# EAGLE design MRCS-ATSN (EAGLE 7.7.0)
Dynamic/Electret Dispatcher/Operator board by Clint Gilliland
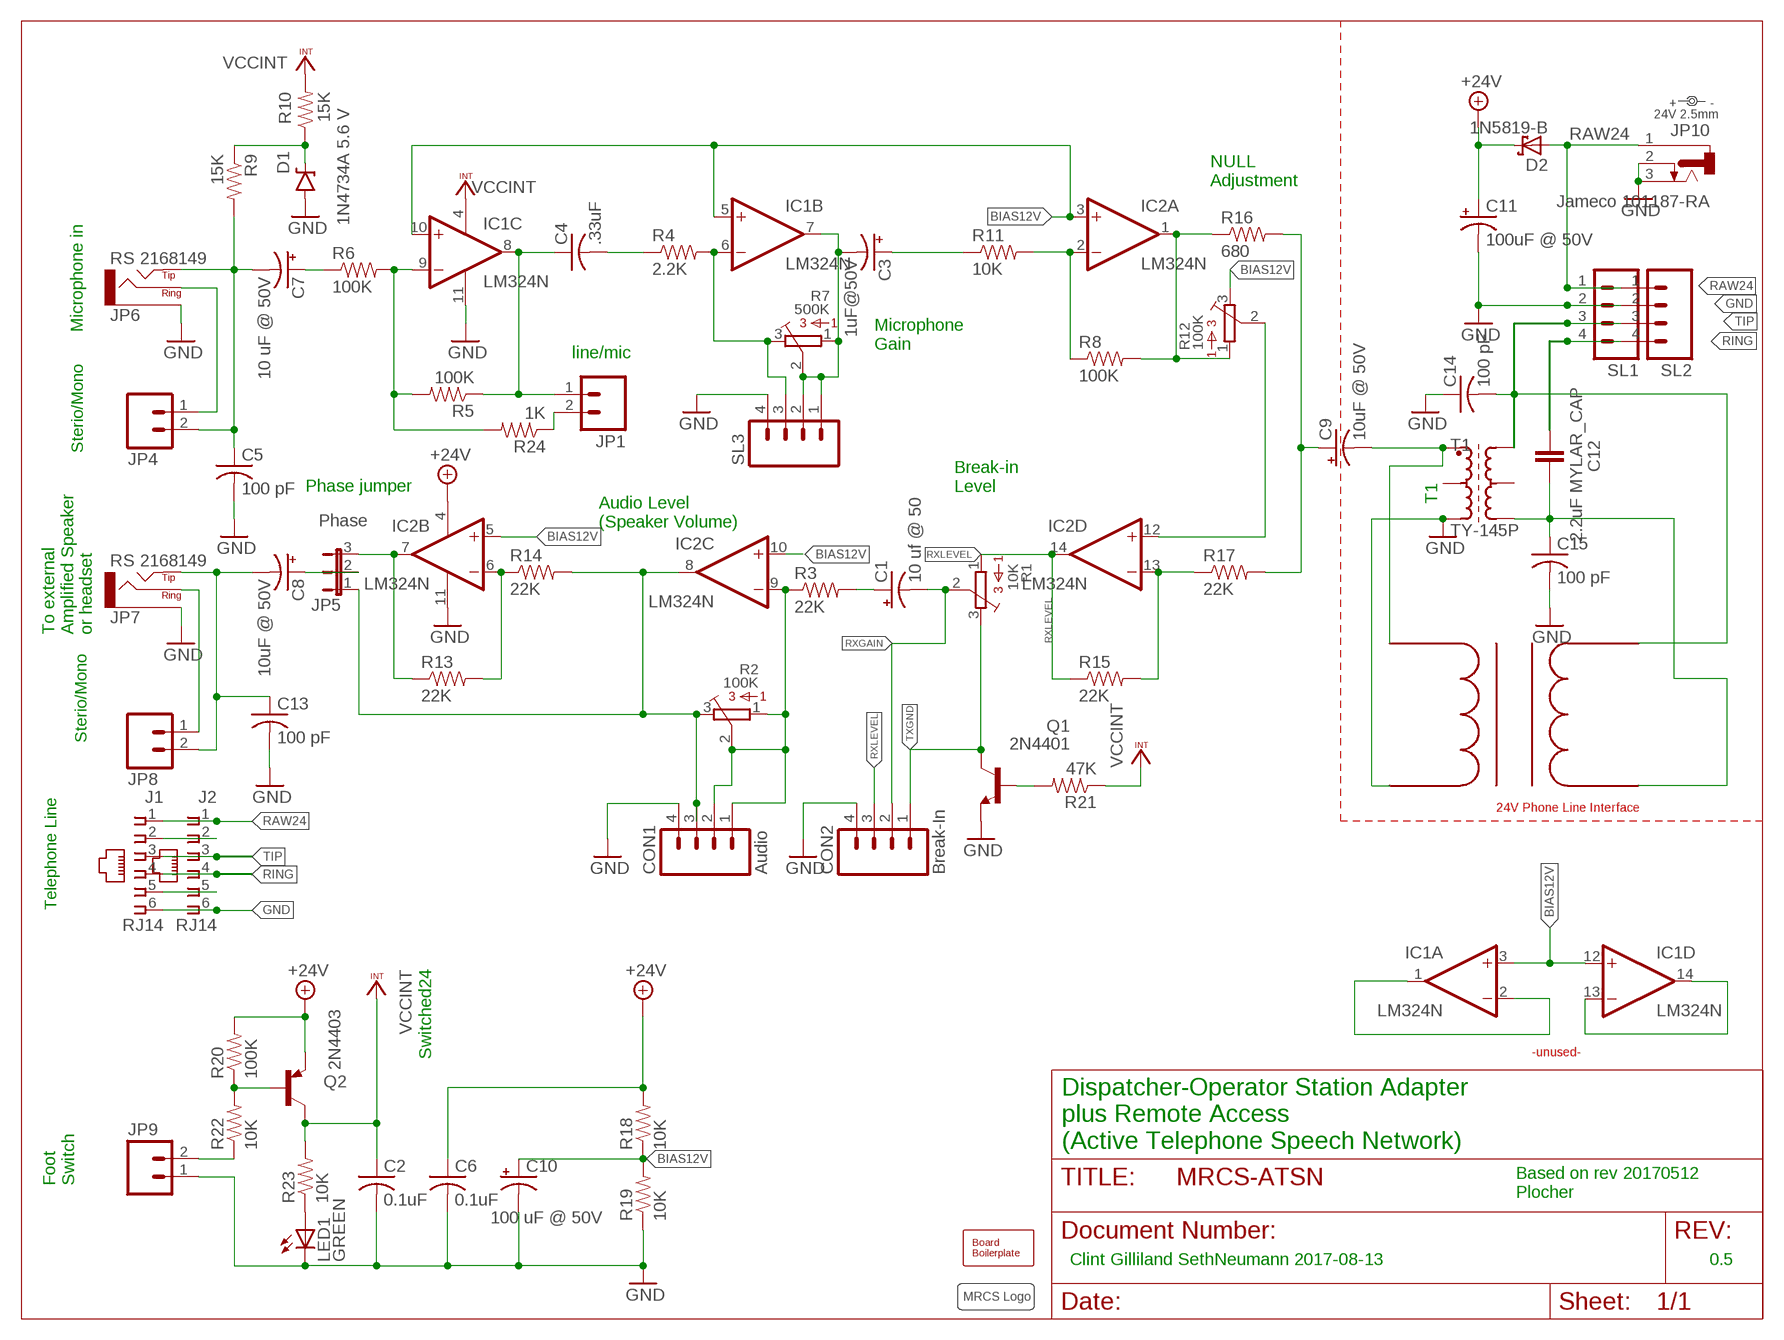
[diagram p0: schematic, sheet 1]

## Parts
BOARD1  BOARD69X100  BOARD69X160  [BOARD-DINRAIL-2.7IN-16CM]
C1  10 uf @ 50  CPOL-USE2-5  [E2-5]
C2  0.1uF  C-US025-030X050  [C025-030X050]
C3  1uF@50V  CPOL-USE2-5  [E2-5]
C4  .33uF  C-US050-050X075  [C050-050X075]
C5  100 pF  C-US050-025X075  [C050-025X075]
C6  0.1uF  C-US025-030X050  [C025-030X050]
C7  10 uF @ 50V  CPOL-USE2-5  [E2-5]
C8  10uF @ 50V  CPOL-USE2-5  [E2-5]
C9  10uF @ 50V  CPOL-USE2-5  [E2-5]
C10  100 uF @ 50V  CPOL-USE3.5-10  [E3.5-10]
C11  100uF @ 50V  CPOL-USE3.5-10  [E3.5-10]
C12  2.2uF MYLAR_CAP  C15/9  [C15B9]
C13  100 pF  C-US050-025X075  [C050-025X075]
C14  100 pF  C-US025-030X050  [C025-030X050]
C15  100 pF  C-US025-030X050  [C025-030X050]
CON1  Audio  CONNECTOR-M04LOCK  [1X04_LOCK]
CON2  Break-In  CONNECTOR-M04LOCK  [1X04_LOCK]
D1  1N4734A 5.6 V  DIODE-ZENERPTH  [DIODE-ZENER]
D2  1N5819-B  [DO41-7.6]
IC1  LM324N  [DIL14]
IC2  LM324N  [DIL14]
J1  RJ14  CONNECTOR-RJ25-43860-2-MOLEX  [RJ25-INVERTED]
J2  RJ14  CONNECTOR-RJ25-43860-2-MOLEX  [RJ25-INVERTED]
JP1  CONNECTOR-M021X02-LOCK  [1X02_LOCK]
JP4  CONNECTOR-M021X02-LOCK  [1X02_LOCK]
JP5  Phase  JUMPER-3PTH-LOCK  [1X03]
JP6  RS 2168149  CONNECTOR-AUDIO3.5MM-ADAMTECH  [AUDIO-JACK-3.5MM_STEREO]
JP7  RS 2168149  CONNECTOR-AUDIO3.5MM-ADAMTECH  [AUDIO-JACK-3.5MM_STEREO]
JP8  CONNECTOR-M021X02-LOCK  [1X02_LOCK]
JP9  CONNECTOR-M02508-LOCK  [MSTB2]
JP10  Jameco 101187-RA  CONNECTOR-DC-POWER-RA  [DCJ0202]
LED1  GREEN  LED3MM  [LED3MM]
POWER  24V 2.5mm  DOC-POWER_LABEL  [POWER_USAGE]
Q1  2N4401  29-NPN-TO92-EBC  [TO92-EBC]
Q2  2N4403  2N4126  [TO92-CBE]
R1  10K  3386-K  [3386K]
R2  100K  3386-K  [3386K]
R3  22K  RESISTORPTH-1/4W  [AXIAL-0.4]
R4  2.2K  RESISTORPTH-1/4W  [AXIAL-0.4]
R5  100K  RESISTORPTH-1/4W  [AXIAL-0.4]
R6  100K  RESISTORPTH-1/4W  [AXIAL-0.4]
R7  500K  3386-K  [3386K]
R8  100K  RESISTORPTH-1/4W  [AXIAL-0.4]
R9  15K  RESISTORPTH-1/4W  [AXIAL-0.4]
R10  15K  RESISTORPTH-1/4W  [AXIAL-0.4]
R11  10K  RESISTORPTH-1/4W  [AXIAL-0.4]
R12  100K  3386-K  [3386K]
R13  22K  RESISTORPTH-1/4W  [AXIAL-0.4]
R14  22K  RESISTORPTH-1/4W  [AXIAL-0.4]
R15  22K  RESISTORPTH-1/4W  [AXIAL-0.4]
R16  680  RESISTORPTH-1/4W  [AXIAL-0.4]
R17  22K  RESISTORPTH-1/4W  [AXIAL-0.4]
R18  10K  RESISTORPTH-1/4W  [AXIAL-0.4]
R19  10K  RESISTORPTH-1/4W  [AXIAL-0.4]
R20  100K  RESISTORPTH-1/4W  [AXIAL-0.4]
R21  47K  RESISTORPTH-1/4W  [AXIAL-0.4]
R22  10K  RESISTORPTH-1/4W  [AXIAL-0.4]
R23  10K  RESISTORPTH-1/4W  [AXIAL-0.4]
R24  1K  RESISTORPTH-1/4W  [AXIAL-0.4]
SL1  CONNECTOR-M04POLAR_LOCK  [MOLEX-1X4_LOCK]
SL2  CONNECTOR-M04POLAR_LOCK  [MOLEX-1X4_LOCK]
SL3  CONNECTOR-M04POLAR_LOCK  [MOLEX-1X4_LOCK]
T1  TY-145P  [TRANFORMER]
U$1  MRCS-LOGOBOT-LARGE  [MRCS-LOGO]
U$2  EI14_600-600  [XFMR580X500]

## Nets
+24V [Power]: C6.1 C11.+ D2.C IC2.4(P:V+) Q2.E R18.P$2 R20.P$2
BIAS12V [Power]: C10.+ IC1.5(B:+IN) IC1.10(C:+IN) IC2.3(A:+IN) IC2.5(B:+IN) IC2.10(C:+IN) R12.3 R18.P$1 R19.P$2
GND [Power]: C2.2 C5.2 C6.2 C10.- C11.- C13.2 C14.1 C15.2 CON1.4 CON2.4 D1.P$2(A) IC1.11(P:V-) IC2.11(P:V-) J1.6 J2.6 JP6.GND(SLEEVE) JP7.GND(SLEEVE) JP9.1 JP10.2 JP10.3 LED1.K(C) Q1.E R19.P$1 SL1.2 SL2.2 SL3.4 T1.3(E1) U$2.PBOTTOM
MICPOWER: D1.P$1(C) R9.P$1 R10.P$1
MICRING: JP4.1 JP6.RING
MICTIP: C5.1 C7.- JP4.2 JP6.TIP R9.P$2
N$1: C7.+ R6.P$1
N$2: IC1.1(A:OUT) IC1.2(A:-IN)
N$3: JP1.2 R24.P$1
N$4: IC1.3(A:+IN) IC1.12(D:+IN)
N$5: Q2.B R20.P$1 R22.P$2
N$6: IC1.9(C:-IN) R5.P$2 R6.P$2 R24.P$2
N$7: J1.2 J2.2
N$8: C1.+ R3.P$2
N$11: IC2.13(D:-IN) R15.P$2 R17.P$1
N$12: J1.5 J2.5
N$13: C3.- IC1.7(B:OUT) R7.1 R7.2 SL3.1 SL3.2
N$14: IC2.2(A:-IN) R8.P$1 R11.P$2
N$15: IC2.1(A:OUT) R8.P$2 R12.1 R16.P$1
N$16: JP9.2 R22.P$1
N$17: C3.+ R11.P$1
N$18: C4.1 IC1.8(C:OUT) JP1.1 R5.P$1
N$20: CON1.1 CON1.2 IC2.9(C:-IN) R2.1 R2.2 R3.P$1
N$21: LED1.A R23.P$1
N$24: IC2.12(D:+IN) R12.2
N$31: IC1.13(D:-IN) IC1.14(D:OUT)
N$32: C8.+ JP5.2
N$38: IC1.6(B:-IN) R4.P$2 R7.3 SL3.3
N$39: C4.2 R4.P$1
N$40: CON1.3 IC2.8(C:OUT) JP5.1 R2.3 R14.P$2
N$41: IC2.7(B:OUT) JP5.3 R13.P$1
N$43: IC2.6(B:-IN) R13.P$2 R14.P$1
Q1BASE: Q1.B R21.P$2
RAW24 [Power]: D2.A J1.1 J2.1 JP10.1 SL1.1 SL2.1
RING [PHONE]: C12.2 J1.4 J2.4 SL1.4 SL2.4
RING-ISOLATED [PHONE]: C12.1 C15.1 T1.4(E2) U$2.SBOTTOM
RXGAIN: C1.- CON2.2 R1.2
RXLEVEL: CON2.3 IC2.14(D:OUT) R1.1 R15.P$1
SPKRRING: JP7.RING JP8.1
SPKRTIP: C8.- C13.1 JP7.TIP JP8.2
TELCO-IN: C9.- T1.1(A1) U$2.PTOP
TELCO-IN-ISOLATED: C9.+ R16.P$2 R17.P$2
TIP [PHONE]: C14.2 J1.3 J2.3 SL1.3 SL2.3 T1.6(A2) U$2.STOP
TXGND: CON2.1 Q1.C R1.3
VCCINT [Power]: C2.1 IC1.4(P:V+) Q2.C R10.P$2 R21.P$1 R23.P$2
Unconnected: T1.2(C1) T1.5(C2)

## Notes on the sheet
- NULL
  Adjustment
- Microphone in
- Microphone
  Gain
- line/mic
- Sterio/Mono
- T1
- Phase jumper
- Break-in 
  Level
- Audio Level
  (Speaker Volume)
- To external
  Amplified Speaker
  or headset
- Sterio/Mono
- 24V Phone Line Interface
- Telephone Line
- Switched24 | -unused-
- Dispatcher-Operator Station Adapter
  plus Remote Access
  (Active Telephone Speech Network)
- Foot
  Switch
- Based on rev 20170512
  Plocher
- Clint Gilliland SethNeumann 2017-08-13 | 0.5

## Library data of the parts
BOARD1 = SPCoast:BOARD
C1 C3 C7-C11 = rcl:CPOL-US: POLARIZED CAPACITOR, American symbol
C2 C4-C6 C13-C15 = rcl:C-US: CAPACITOR, American symbol
C12 = capacitor-wima:C: CAPACITOR naming: grid - package width
CON1 CON2 = SPCoast 2017_04:CONNECTOR-M04: Header 4 Standard 4-pin 0.1" header. Use with straight break away headers (SKU : PRT-00116), right angle break away headers (PRT-00553), swiss pins (PRT-00743), machine pins (PRT-00117), and female headers (PRT-00115). Molex polarized connector foot print use with SKU : PRT-08231 with associated crimp pins and housings. 1MM SMD Version SKU: PRT-10208
D1 = SparkFun-DiscreteSemi:DIODE-ZENER: Zener Diode Production Part - 8199 3.4V Zener Voltage
D2 = diode:1N581*: 1.0A SCHOTTKY BARRIER RECTIFIER Source: http://www.diodes.com/datasheets/ds23001.pdf
IC1 IC2 = linear:LM324: OP AMP
J1 J2 = SPCoast:CONNECTOR-RJ25: AMP connector
JP1 JP4 JP8 JP9 = SPCoast:CONNECTOR-M02: PHOENIX CONNECTOR
JP5 = SPCoast:JUMPER-3
JP6 JP7 = SPCoast:CONNECTOR-AUDIO: 3.5mm Audio Jack Simple 3.5mm common PCB mount audio jack. SKU: PRT-08032
JP10 = SPCoast:CONNECTOR-DC-POWER: DC POWER JACK Source: DCJ0202.pdf
LED1 = SparkFun-LED:LED: LEDs Standard schematic elements and footprints for 5mm, 3mm, 1206, and 0603 sized LEDs. 5mm - Spark Fun Electronics SKU : COM-00529 (and others)
POWER = SPCoast:DOC-POWER_LABEL
Q1 = transistor:*-NPN-: NPN Transistror BF959 corrected 2008.03.06
Q2 = transistor-pnp:2N4126*: PNP Transistror
R1 R2 R7 R12 = bourns_test:3386-: 3386 Series 3/8" Square Trimmer
R3-R6 R8-R11 R13-R24 = SparkFun-Resistors:RESISTOR: Resistor Basic schematic elements and footprints for 0603, 1206, and PTH resistors.
SL1-SL3 = SPCoast:CONNECTOR-M04: Header 4 Standard 4-pin 0.1" header. Use with straight break away headers (SKU : PRT-00116), right angle break away headers (PRT-00553), swiss pins (PRT-00743), machine pins (PRT-00117), and female headers (PRT-00115). Molex polarized connector foot print use with SKU : PRT-08231 with associated crimp pins and housings. 1MM SMD Version SKU: PRT-10208
T1 = SPCoast:TY-145P
U$1 = SPCoast:MRCS-LOGO
U$2 = MRCSEI14:EI14_600-600: EI14 600-600 ohm coupling xfmr - non saturating

## Net classes
0 default: width 0.254 mm, clearance 0.254 mm
1 Power: width 0.406 mm, clearance 0.254 mm
2 PHONE: width 0.305 mm, clearance 0.381 mm

## Board
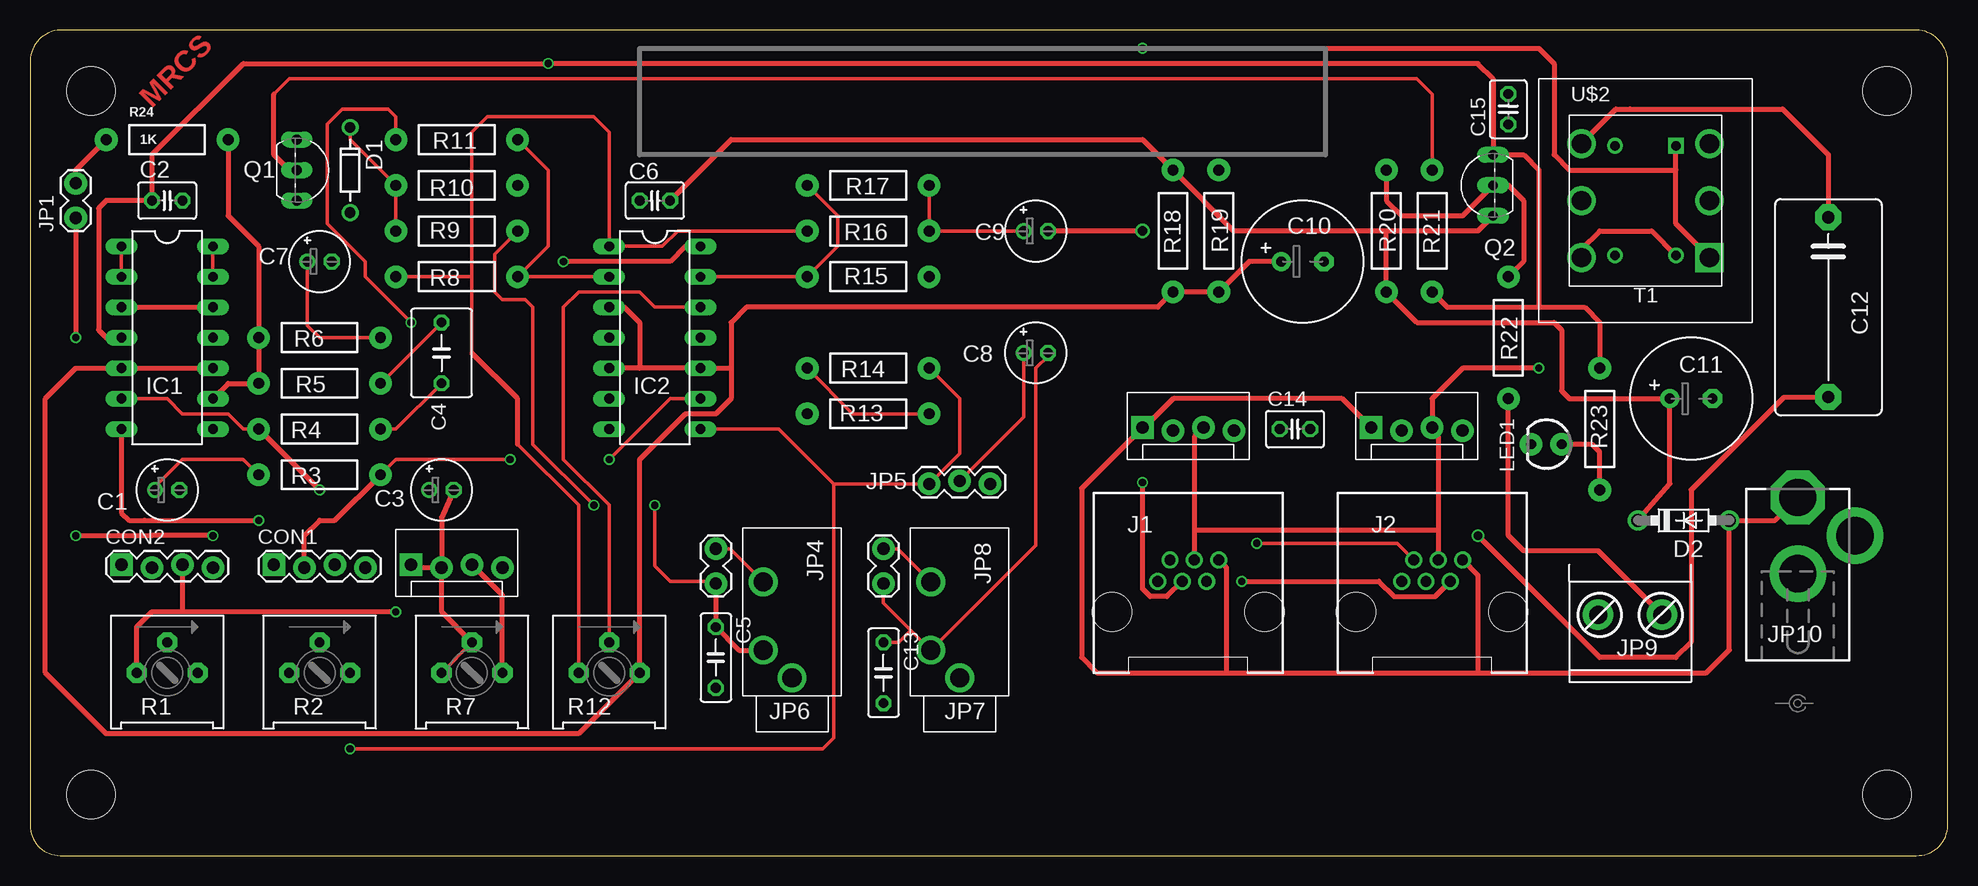
[diagram p1: board, top side]
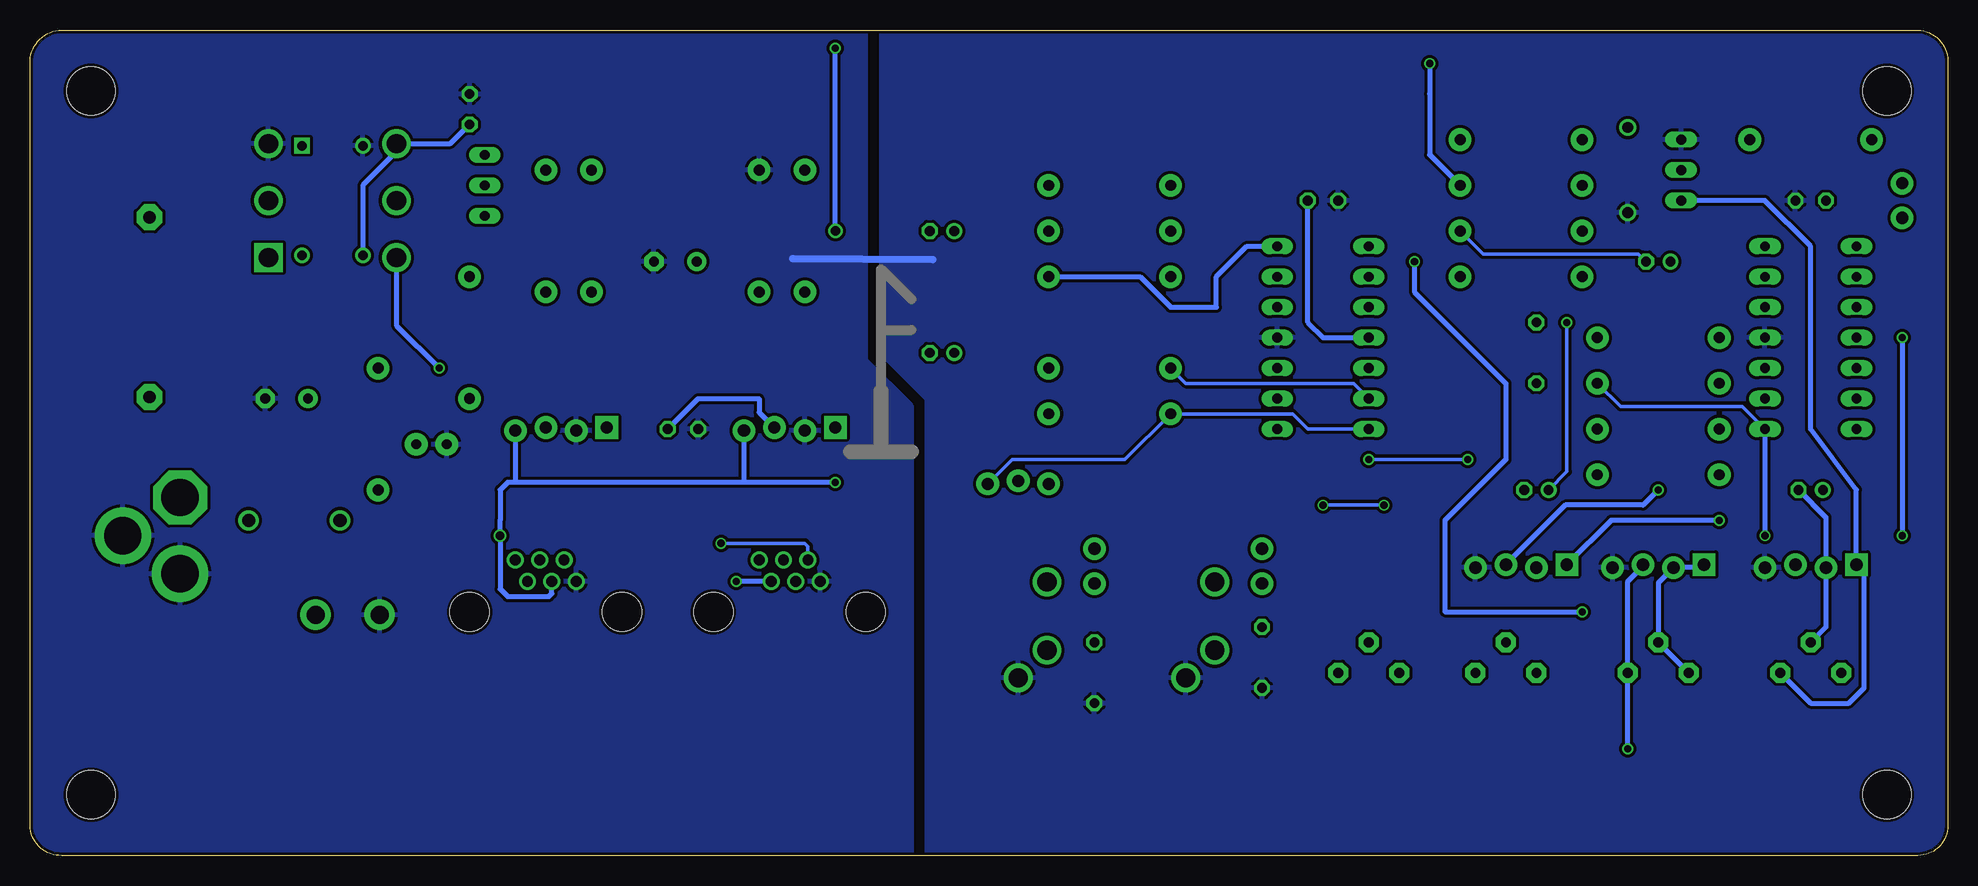
[diagram p2: board, bottom side, seen from below]

Size 159.82 x 68.83 mm. Coordinates in mm from the lower left corner, seen from the top.
Copper layers (1*16): Top 0.035mm / dielectric 1.5mm / Bottom 0.035mm
Design rules "SeeedStudio_2layer_DRU_no_angle_20140221": minimum track width 6mil, minimum drill 12mil, track to track 6mil, track to pad 6mil, pad to pad 6mil, via to via 6mil, smd to smd 0mil, copper to edge 10mil, drill to drill 10mil, minimum pad ring 10mil, minimum via ring 6mil, stop-mask expansion 2mil, vias tented up to drill 100mil, thermal gap 10mil

### Footprints (pad centres in the part's own frame; a part is rotated, then mirrored left to right if it is on the bottom)
BOARD-DINRAIL-2.7IN-16CM = hole 4: 154.742,5.08; 5.08,63.754; 154.742,63.754; 5.08,5.08
E2-5 = drill 0.813 pad 1.27: + -1.016,0 | drill 0.813 pad 1.27 octagon: - 1.016,0
C025-030X050 = drill 0.813 octagon: 1 -1.27,0; 2 1.27,0
C050-050X075 = drill 0.813 octagon: 1 -2.54,0; 2 2.54,0
C050-025X075 = drill 0.813 octagon: 1 -2.54,0; 2 2.54,0
E3.5-10 = drill 0.813 pad 1.6: + -1.778,0 | drill 0.813 pad 1.6 octagon: - 1.778,0
C15B9 = drill 1.016 pad 2.159 octagon: 1 -7.493,0; 2 7.493,0
1X04_LOCK = drill 1.016 pad 1.88 square: 1 0,0.127 | drill 1.016 pad 1.88: 2 2.54,-0.127; 3 5.08,0.127; 4 7.62,-0.127
DIODE-ZENER = drill 0.9: P$1 -3.556,0; P$2 3.556,0
DO41-7.6 = drill 1.1 pad 1.7: A 3.81,0; C -3.81,0
DIL14 = drill 0.813 long: 1 -7.62,-3.81; 2 -5.08,-3.81; 3 -2.54,-3.81; 4 0,-3.81; 5 2.54,-3.81; 6 5.08,-3.81; 7 7.62,-3.81; 8 7.62,3.81; 9 5.08,3.81; 10 2.54,3.81; 11 0,3.81; 12 -2.54,3.81; 13 -5.08,3.81; 14 -7.62,3.81
RJ25-INVERTED = drill 0.9 pad 1.4: 1 2.54,4.318; 2 1.524,2.54; 3 0.508,4.318; 4 -0.508,2.54; 5 -1.524,4.318; 6 -2.54,2.54 | hole 3.251: -6.35,0; 6.35,0
1X02_LOCK = drill 1.016 pad 1.88: 1 -0.178,0; 2 2.718,0
1X03 = drill 1.016 pad 1.88: 1 0,-0.127; 2 2.54,0.127; 3 5.08,-0.127
AUDIO-JACK-3.5MM_STEREO = drill 1.6: GND -5.5,0; RING 2.5,2.4; TIP -3.2,2.4
MSTB2 = drill 1.5 pad 2.54: 1 -2.667,1.016; 2 2.667,1.016
DCJ0202 = drill 3.1 pad 4.5 octagon: 1 0,3.175 | drill 3.1 pad 4.7: 2 4.763,0; 3 0,-3.175
LED3MM = drill 0.813 pad 1.88: A -1.27,0; K 1.27,0
TO92-EBC = drill 0.813 long: B 0,-1.27; C 2.54,-1.27; E -2.54,-1.27
TO92-CBE = drill 0.813 long: B 0,0; C 2.54,0; E -2.54,0
3386K = drill 0.813 pad 1.676 octagon: 1 -2.54,0; 2 0,2.54; 3 2.54,0
AXIAL-0.4 = drill 0.9 pad 1.88: P$1 -5.08,0; P$2 5.08,0
MOLEX-1X4_LOCK = drill 1.016 pad 1.88 square: 1 0,0.127 | drill 1.016 pad 1.88: 2 2.54,-0.127; 3 5.08,0.127; 4 7.62,-0.127
TRANFORMER = drill 1.6 square: 1 4.75,5.334 | drill 1.6: 2 0,5.334; 3 -4.75,5.334; 4 -4.75,-5.334; 5 0,-5.334; 6 4.75,-5.334
XFMR580X500 = drill 0.8: PBOTTOM -2.54,4.572; SBOTTOM -2.54,-4.572; STOP 2.54,-4.572 | drill 0.8 square: PTOP 2.54,4.572

### Placement (x,y rotation side)
BOARD1  0,0 0 top
C1  11.43,30.48 0 top
C2  11.43,54.61 0 top
C3  34.29,30.48 0 top
C4  34.29,41.91 270 top
C5  57.15,16.51 270 top
C6  52.07,54.61 180 top
C7  24.13,49.53 0 top
C8  83.82,41.91 0 top
C9  83.82,52.07 0 top
C10  106.05,49.53 0 top
C11  138.43,38.1 0 top
C12  149.86,45.72 270 top
C13  71.12,15.24 270 top
C14  105.41,35.56 0 top
C15  123.19,62.23 90 top
CON1  20.32,24.13 0 top
CON2  7.62,24.13 0 top
D1  26.67,57.15 270 top
D2  137.8,27.94 0 top
IC1  11.43,43.18 270 top
IC2  52.07,43.18 270 top
J1  96.52,20.32 0 top
J2  116.84,20.32 0 top
JP1  3.81,53.34 90 top
JP4  57.15,25.4 270 top
JP5  74.93,31.11 0 top
JP6  63.5,20.32 90 top
JP7  77.47,20.32 90 top
JP8  71.12,25.4 270 top
JP9  133.35,19.05 0 top
JP10  147.32,26.67 0 top
LED1  126.37,34.29 180 top
POWER  147.32,12.7 270 top
Q1  23.5,57.15 270 top
Q2  121.92,55.88 90 top
R1  11.43,15.24 0 top
R2  24.13,15.24 0 top
R3  24.13,31.75 180 top
R4  24.13,35.56 180 top
R5  24.13,39.37 180 top
R6  24.13,43.18 180 top
R7  36.83,15.24 0 top
R8  35.56,48.26 180 top
R9  35.56,52.07 0 top
R10  35.56,55.88 0 top
R11  35.56,59.69 0 top
R12  48.26,15.24 0 top
R13  69.85,36.83 0 top
R14  69.85,40.64 0 top
R15  69.85,48.26 180 top
R16  69.85,52.07 0 top
R17  69.85,55.88 0 top
R18  95.25,52.07 90 top
R19  99.06,52.07 270 top
R20  113.03,52.07 270 top
R21  116.84,52.07 90 top
R22  123.19,43.18 90 top
R23  130.81,35.56 90 top
R24  11.43,59.69 0 top
SL1  92.71,35.56 0 top
SL2  111.76,35.56 0 top
SL3  31.75,24.13 0 top
T1  134.62,54.61 270 top
U$1  88.9,33.66 0 top
U$2  134.62,54.61 0 top

### Tracks (layer width: path | path; a pad name or v marks a point on that pad's centre or on a via)
+24V
  Top 0.406: C6.1 58.42,59.69 92.71,59.69 R18.P$2 100.33,52.07 113.03,52.07 | D2.C 136.65,30.99 C11.+ 128.27,38.1 127.64,38.73 127.64,43.81 127,44.45 115.57,44.45 R20.P$2 113.03,52.07 | Q2.E 120.65,52.07 113.03,52.07
  Bottom 0.406: IC2.4 52.07,43.18 53.34,44.45 C6.1
BIAS12V
  Top 0.406: IC1.10 IC1.5 3.81,40.64 1.27,38.1 1.27,15.24 6.35,10.16 45.72,10.16 R12.3 50.8,33.02 54.61,36.83 57.15,36.83 58.42,38.1 58.42,40.64 | IC2.3 49.53,45.72 50.8,44.45 50.8,40.64 | 50.8,40.64 IC2.5 | 50.8,40.64 IC2.10 58.42,40.64 | C10.+ 101.6,49.53 R19.P$2 R18.P$1 93.98,45.72 59.69,45.72 58.42,44.45 58.42,40.64
GND
  Bottom 0.61: 84.61,49.71 96.27,49.78
  pour Bottom: 160.02,68.58 160.02,0 86.36,0 86.36,37.47 90.17,41.27 90.17,68.58
  pour Bottom: 0,68.58 88.9,68.58 88.9,41.91 85.09,38.1 85.09,0 0,0
MICPOWER
  Top 0.305: R9.P$1 R10.P$1 26.67,59.69 D1.P$1
MICRING
  Top 0.305: JP6.RING 58.34,25.58 JP4.1
MICTIP  (via drill 0.6)
  Top 0.305: v46.99,29.21 41.91,34.29 41.91,45.72 41.28,46.35 39.37,46.35 38.74,46.99 38.74,50.16 R9.P$2 | v52.07,29.21 52.07,24.13 53.34,22.86 57.15,22.86 JP4.2
  Top 0.406: JP4.2 C5.1 59.08,17.12 JP6.TIP
  Bottom 0.305: C7.- 25.78,50.16 38.74,50.16 R9.P$2 | v46.99,29.21 v52.07,29.21
N$1
  Top 0.305: C7.+ 23.12,44.2 24.13,43.18 R6.P$1
N$2
  Top 0.305: IC1.2 IC1.1
N$3
  Top 0.406: JP1.2 3.81,57.15 R24.P$1
N$4
  Top 0.406: IC1.3 10.16,45.72 12.7,45.72 IC1.12
N$5
  Top 0.406: R22.P$2 124.46,49.53 124.46,54.61 123.19,55.88 Q2.B 119.38,53.34 114.3,53.34 113.03,54.61 R20.P$1
N$6
  Top 0.406: R24.P$2 16.51,53.34 19.05,50.8 R6.P$2 R5.P$2 16.51,39.37 IC1.9
N$7  (via drill 0.6)
  Top 0.406: v100.97,22.86 112.4,22.86 113.67,21.59 117.1,21.59 J2.2
  Bottom 0.406: J1.2 v100.97,22.86
N$8
  Top 0.305: C1.+ 10.42,30.73 12.7,33.02 17.78,33.02 R3.P$2
N$11
  Top 0.305: IC2.13 R15.P$2 67.31,50.8 67.31,53.34 R17.P$1
N$12  (via drill 0.6)
  Top 0.305: J2.5 113.92,26.04 v102.24,26.04
  Bottom 0.305: J1.5 95,25.78 95.25,26.04 100.97,26.04 v102.24,26.04
N$13  (via drill 0.6)
  Top 0.305: R7.2 R7.1
  Top 0.406: R7.2 34.29,20.32 SL3.2 | SL3.1 32.01,24 SL3.2 | C3.- 34.29,28.19 SL3.2 | IC1.7 7.62,28.57 8.26,27.94 9.53,27.94 10.16,27.94 v19.05,27.94
  Bottom 0.406: v19.05,27.94 28.07,27.94 SL3.1
N$14
  Top 0.305: R11.P$2 43.18,57.15 43.18,50.8 R8.P$1 IC2.2
N$15
  Top 0.305: 36.83,41.91 36.83,48.26 | R12.1 45.72,29.21 40.64,34.29 | R16.P$1 53.98,52.07 52.71,50.8 IC2.1 48.26,60.33 46.99,61.59 38.1,61.59 36.83,60.33 36.83,48.26 | R8.P$2 36.83,48.26
  Top 0.406: 40.64,34.29 40.64,38.1 36.83,41.91
N$16
  Top 0.406: JP9.2 130.69,25.4 124.46,25.4 123.19,26.67 R22.P$1
N$17  (via drill 0.6)
  Top 0.305: v31.75,44.45 27.94,48.26 27.94,49.53 24.77,52.7 24.77,60.96 26.04,62.23 29.85,62.23 30.48,61.59 R11.P$1
  Bottom 0.305: C3.+ 31.75,32 v31.75,44.45
N$18  (via drill 0.6)
  Top 0.305: R5.P$1 C4.1
  Top 0.406: JP1.1 v3.81,43.18 | v15.24,26.67 10.16,26.67 v3.81,26.67
  Bottom 0.305: IC1.8 17.12,37.44 27.28,37.44 R5.P$1
  Bottom 0.406: v3.81,43.18 v3.81,26.67 | IC1.8 15.24,30.48 15.24,29.21 v15.24,26.67
N$20  (via drill 0.6)
  Top 0.305: R3.P$1 30.48,33.02 v40.01,33.02 | v48.26,33.02 53.34,38.1 IC2.9
  Top 0.406: CON1.2 22.86,26.67 24.13,27.94 25.4,27.94 R3.P$1
  Bottom 0.305: v40.01,33.02 v48.26,33.02
  Bottom 0.406: CON1.2 22.86,24.13 | CON1.1 20.58,24 CON1.2 | CON1.2 24.13,22.73 R2.2 R2.1
N$21
  Top 0.406: R23.P$1 130.81,33.66 130.18,34.29 LED1.A
N$24
  Top 0.305: R12.2 48.26,29.21 44.45,33.02 44.45,45.72 45.72,46.99 50.8,46.99 52.07,45.72 IC2.12
N$31
  Top 0.305: IC1.13 IC1.14
N$32
  Top 0.305: JP5.2 82.81,36.58 C8.+
N$38  (via drill 0.6)
  Top 0.305: R4.P$2 17.78,35.56 16.51,36.83 12.7,36.83 11.43,38.1 IC1.6
  Top 0.406: R7.3 39.37,21.72 SL3.3 | R4.P$2 v24.13,30.48
  Bottom 0.406: v24.13,30.48 25.4,29.21 31.88,29.21 SL3.3
N$39
  Top 0.305: R4.P$1 30.48,35.56 C4.2
N$40  (via drill 0.6)
  Top 0.305: 66.97,30.99 JP5.1 77.47,33.53 77.47,38.1 R14.P$2 | 66.97,30.99 66.97,9.81 66.04,8.89 v26.67,8.89 | 66.97,30.99 62.39,35.56 IC2.8
  Bottom 0.406: v26.67,8.89 R2.3 26.67,22.86 25.4,24.13 | 25.4,24.13 CON1.3 | CON1.3 25.4,24.13 | 25.4,24.13 CON1.3
N$41
  Bottom 0.305: IC2.7 53.34,35.56 54.61,36.83 R13.P$1 68.58,33.02 77.98,33.02 JP5.3
N$43
  Top 0.305: R14.P$1 68.58,36.83 R13.P$2
  Bottom 0.305: R14.P$1 63.5,39.37 49.53,39.37 IC2.6
Q1BASE
  Top 0.305: 20.32,63.5 21.59,64.77 60.96,64.77 62.23,64.77 115.57,64.77 116.84,63.5 R21.P$2
  Top 0.406: Q1.B 21.59,57.15 20.32,58.42 20.32,63.5
RAW24
  Top 0.406: 99.7,15.24 99.7,24 J1.1 | 99.7,15.24 120.65,15.24 | 99.7,15.24 88.9,15.24 87.63,16.51 87.63,30.61 SL1.1 92.84,35.69 95.25,38.1 109.35,38.1 SL2.1 | J2.1 120.65,23.37 120.65,15.24 | JP10.1 145.42,27.94 D2.A 141.61,17.14 139.7,15.24 120.65,15.24
RING  (via drill 0.6, 0.7)
  Top 0.406: J1.4 94.74,21.59 93.35,21.59 92.71,22.23 v92.71,31.11 | v120.65,26.67 130.81,16.51 137.16,16.51 138.43,17.78 138.43,30.48 146.18,38.23 C12.2
  Bottom 0.305: J2.4 116.31,22.89
  Bottom 0.406: SL1.4 100.33,31.11 | J2.4 116.33,21.84 116.59,21.59 120.02,21.59 120.65,22.23 v120.65,26.67 120.65,27.94 120.65,30.48 120.02,31.11 119.38,31.11 | v92.71,31.11 100.33,31.11 | 100.33,31.11 119.38,31.11 | SL2.4 119.38,31.11
RING-ISOLATED
  Top 0.406: T1.4 132.16,62.23 133.35,62.23 146.05,62.23 149.86,58.42 C12.1
  Bottom 0.406: C15.1 124.79,59.36 T1.4 129.29,58.67 132.08,55.88 U$2.SBOTTOM
RXGAIN
  Bottom 0.406: C1.- 10.16,28.19 CON2.2 10.16,19.05 R1.2
RXLEVEL  (via drill 0.6)
  Top 0.406: R1.1 8.89,19.05 10.16,20.32 12.7,20.32 | IC2.14 54.61,50.8 53.34,49.53 v44.45,49.53 | v30.48,20.32 13.97,20.32 12.7,20.32 | CON2.3 12.7,20.32
  Bottom 0.406: R15.P$1 67.31,48.26 64.77,45.72 60.96,45.72 60.96,48.26 58.42,50.8 IC2.14 | v44.45,49.53 44.45,46.99 36.83,39.37 36.83,33.02 41.91,27.94 41.91,20.32 v30.48,20.32
SPKRRING
  Top 0.305: JP7.RING 72.31,25.58 JP8.1
SPKRTIP
  Top 0.305: 73.4,18.79 JP7.TIP 83.82,25.87 83.82,40.64 84.84,41.66 C8.- | 73.4,18.79 71.12,21.07 JP8.2 | 73.4,18.79 72.39,17.78 C13.1
TELCO-IN  (via drill 0.6, 0.8)
  Top 0.406: v92.71,67.31 125.73,67.31 127,66.04 127,58.42 128.27,57.15 137.16,57.15 | v92.71,52.07 C9.- | 137.16,57.15 U$2.PTOP | T1.1 139.96,49.91 137.16,52.7 137.16,57.15
  Bottom 0.406: v92.71,52.07 v92.71,67.31
TELCO-IN-ISOLATED
  Top 0.305: R17.P$2 R16.P$2 C9.+
TIP  (via drill 0.6)
  Top 0.305: 97.03,27.24 97.12,27.15
  Top 0.406: SL1.3 97.03,34.92 97.03,27.24 J1.3 | 117.35,27.15 117.35,34.92 SL2.3 116.84,38.1 119.38,40.64 v125.73,40.64 | 117.35,27.15 J2.3 | 97.12,27.15 117.35,27.15 | 117.38,27.18 117.35,27.15 | T1.6 129.29,50.55 130.81,52.07 135.13,52.07 U$2.STOP
  Bottom 0.406: T1.6 129.29,44.2 v125.73,40.64 | C14.2 104.14,38.1 99.06,38.1 99.06,36.96 SL1.3
TXGND
  Bottom 0.406: R1.3 11.43,12.7 8.26,12.7 6.99,13.97 6.99,23.5 CON2.1 7.62,30.48 11.43,35.56 11.43,50.8 15.24,54.61 21.59,54.61 Q1.C
VCCINT  (via drill 0.6)
  Top 0.406: IC1.4 6.35,43.18 5.72,43.81 5.72,53.98 6.35,54.61 8.26,54.61 C2.1 10.16,58.42 17.78,66.04 v43.18,66.04 120.65,66.04 121.92,64.77 Q2.C 124.46,58.42 125.73,57.15 125.73,45.72 | R21.P$1 118.11,45.72 125.73,45.72 | 125.73,45.72 129.54,45.72 130.81,44.45 R23.P$2
  Bottom 0.406: v43.18,66.04 43.18,63.5 43.18,58.42 R10.P$2

### Text on the board
Top: MRCS
Document: White soldermask / Black silkscreen
tDocu: rev 0.5 | 2017-08 | MRCS ATSN | Active Telephone Speech Network | Clint Gilliland | Seth Neumann | John Plocher | 24v | gnd | tip | ring | 24v | gnd | tip | ring | GND | mono | mono | Break In / Volume | Audio / Volume | Microphone / Volume | NULL / Adjust | Microphone | Audio Out | Telephone line | Telephone line | Push to / talk | 24VDC
bDocu: MRCS Active Telephone Speech Network | Prop 65 WARNING: / This product contains a chemical known to the State of California / to cause birth defects or other reproductive harm. | www.ModelRailroadControlSystems.com